# EAGLE design Modulo Actuador (EAGLE 9.3.0)
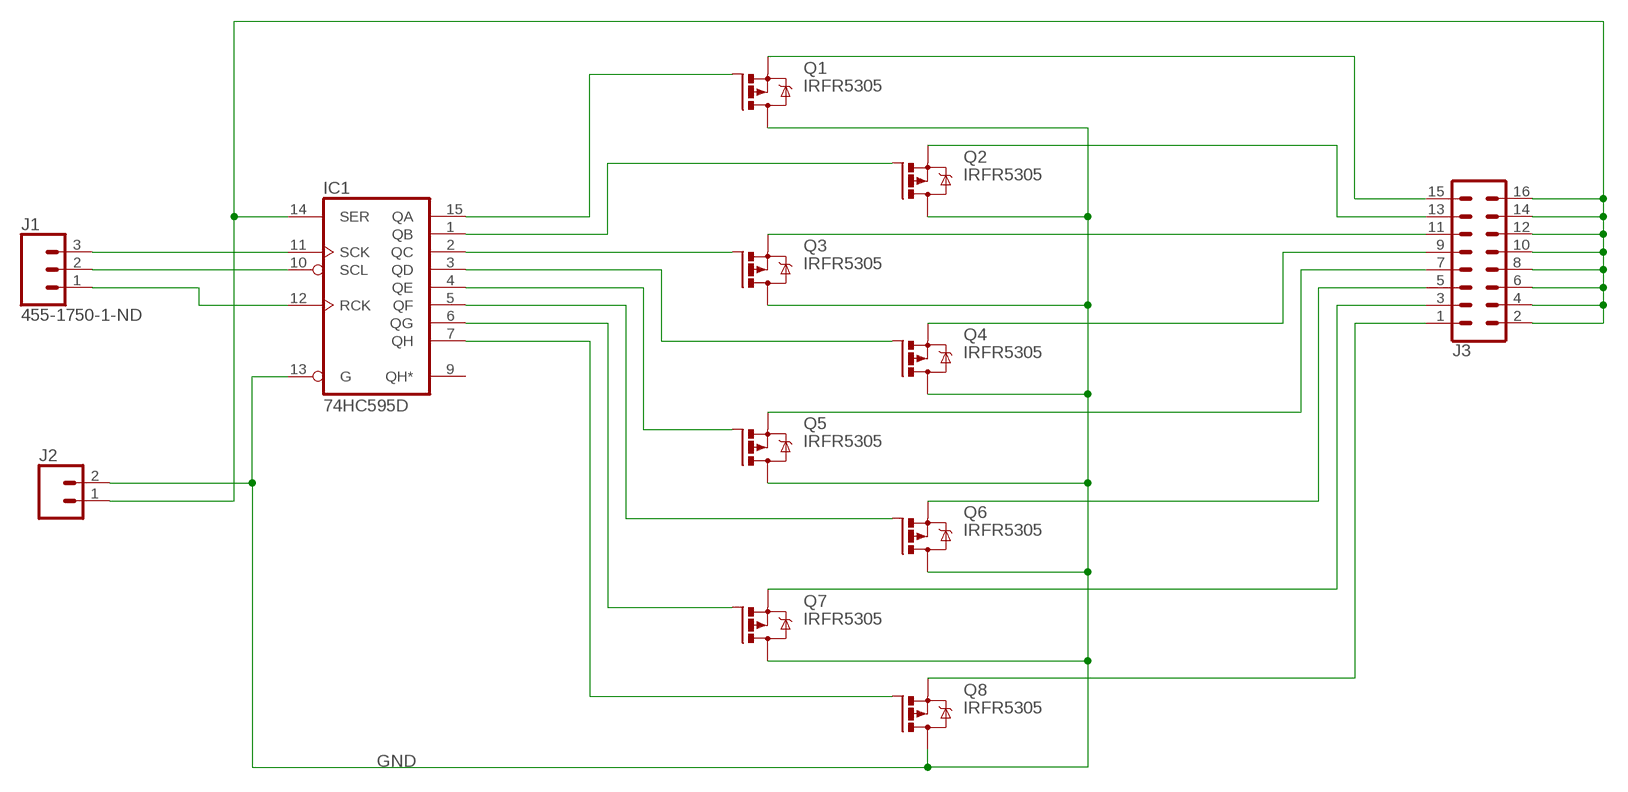
[diagram p0: schematic, sheet 1]

## Parts
IC1  74HC595D  [SO16]
J1  455-1750-1-ND  CONN_03  [1X03]
J2  CONN_02  [1X02]
J3  CONN_08X2_HEADER  [2X8]
Q1  IRFR5305  [D-PAK_TO252AA]
Q2  IRFR5305  [D-PAK_TO252AA]
Q3  IRFR5305  [D-PAK_TO252AA]
Q4  IRFR5305  [D-PAK_TO252AA]
Q5  IRFR5305  [D-PAK_TO252AA]
Q6  IRFR5305  [D-PAK_TO252AA]
Q7  IRFR5305  [D-PAK_TO252AA]
Q8  IRFR5305  [D-PAK_TO252AA]

## Nets
GND: IC1.13(G) J2.2 Q1.4(D) Q2.4(D) Q3.4(D) Q4.4(D) Q5.4(D) Q6.4(D) Q7.4(D) Q8.4(D)
N$1: IC1.14(SER) J2.1 J3.2 J3.4 J3.6 J3.8 J3.10 J3.12 J3.14 J3.16
N$3: IC1.12(RCK) J1.1
N$4: IC1.10(SCL) J1.2
N$5: IC1.11(SCK) J1.3
N$6: IC1.15(QA) Q1.1(G)
N$7: IC1.1(QB) Q2.1(G)
N$8: IC1.2(QC) Q3.1(G)
N$9: IC1.3(QD) Q4.1(G)
N$10: IC1.4(QE) Q5.1(G)
N$11: IC1.5(QF) Q6.1(G)
N$12: IC1.6(QG) Q7.1(G)
N$13: IC1.7(QH) Q8.1(G)
N$14: J3.15 Q1.3(S)
N$15: J3.13 Q2.3(S)
N$16: J3.11 Q3.3(S)
N$17: J3.1 Q8.3(S)
N$18: J3.3 Q7.3(S)
N$19: J3.5 Q6.3(S)
N$20: J3.7 Q5.3(S)
N$21: J3.9 Q4.3(S)
Unconnected: IC1.9(QH*)

## Power pins joined to a net without a drawn wire
GND: IC1.8(GND)
VCC: IC1.16(VCC)

## Library data of the parts
IC1 = 74xx-eu:74*595: 8-bit SHIFT REGISTER, output latch
J1 = SparkFun-Connectors:CONN_03: Multi connection point. Often used as Generic Header-pin footprint for 0.1 inch spaced/style header connections On any of the 0.1 inch spaced packages, you can populate with these: Break Away Headers - Straight <https://www.sparkfun.com/products/116> (PRT-00116) Break Away Male Headers - Right Angle <https://www.sparkfun.com/products/553> (PRT-00553) Female Headers <https://www.sparkfun.com/products/115> (PRT-00115) Break Away Headers - Machine Pin <https://www.sparkfun.com/products/117> (PRT-00117) Break Away Female Headers - Swiss Machine Pin <https://www.sparkfun.com/products/743> (PRT-00743) Stackable Header - 3 Pin (Female, 0.1") <https://www.sparkfun.com/products/13875> (PRT-13875) For SCREWTERMINALS and SPRING TERMINALS visit here: Screw Terimnals on SparkFun.com <https://www.sparkfun.com/search/results?term=Screw+Terminals> (5mm/3.5mm/2.54mm spacing) This device is also useful as a general connection point to wire up your design to another part of your project. Our various solder wires solder well into these plated through hole pads. Hook-Up Wire - Assortment (Stranded, 22 AWG) <https://www.sparkfun.com/products/11375> (PRT-11375) Hook-Up Wire - Assortment (Solid Core, 22 AWG) <https://www.sparkfun.com/products/11367> (PRT-11367) View the entire wire category on our website here <https://www.sparkfun.com/categories/141> Special notes: Molex polarized connector foot print use with SKU : PRT-08232 with associated crimp pins and housings.; PROD_ID: XXX-00000
J2 = SparkFun-Connectors:CONN_02: Multi connection point. Often used as Generic Header-pin footprint for 0.1 inch spaced/style header connections On any of the 0.1 inch spaced packages, you can populate with these: Break Away Headers - Straight <https://www.sparkfun.com/products/116> (PRT-00116) Break Away Male Headers - Right Angle <https://www.sparkfun.com/products/553> (PRT-00553) Female Headers <https://www.sparkfun.com/products/115> (PRT-00115) Break Away Headers - Machine Pin <https://www.sparkfun.com/products/117> (PRT-00117) Break Away Female Headers - Swiss Machine Pin <https://www.sparkfun.com/products/743> (PRT-00743) For SCREWTERMINALS and SPRING TERMINALS visit here: Screw Terimnals on SparkFun.com <https://www.sparkfun.com/search/results?term=Screw+Terminals> (5mm/3.5mm/2.54mm spacing) This device is also useful as a general connection point to wire up your design to another part of your project. Our various solder wires solder well into these plated through hole pads. Hook-Up Wire - Assortment (Stranded, 22 AWG) <https://www.sparkfun.com/products/11375> (PRT-11375) Hook-Up Wire - Assortment (Solid Core, 22 AWG) <https://www.sparkfun.com/products/11367> (PRT-11367) View the entire wire category on our website here <https://www.sparkfun.com/categories/141> Special notes: Molex polarized connector foot print use with: PRT-08233 with associated crimp pins and housings. 2.54_SCREWTERM for use with PRT-10571. 3.5mm Screw Terminal footprints for PRT-08084 5mm Screw Terminal footprints for use with PRT-08432
J3 = SparkFun-Connectors:CONN_08X2: Multi connection point. Often used as Generic Header-pin footprint for 0.1 inch spaced/style header connections You can populate with any combo of single row headers, but if you'd like an exact match, check this: Header - 2x8 (Male, 0.1") <https://www.sparkfun.com/products/13156> (PRT-13156) On any of the 0.1 inch spaced packages, you can populate with these: Break Away Headers - Straight <https://www.sparkfun.com/products/116> (PRT-00116) Break Away Male Headers - Right Angle <https://www.sparkfun.com/products/553> (PRT-00553) Female Headers <https://www.sparkfun.com/products/115> (PRT-00115) Break Away Headers - Machine Pin <https://www.sparkfun.com/products/117> (PRT-00117) Break Away Female Headers - Swiss Machine Pin <https://www.sparkfun.com/products/743> (PRT-00743)
Q1-Q8 = transistor-power:IRF?5305: HEXFET Power MOSFET Source: http://www.irf.com/product-info/datasheets/data/irfr5305pbf.pdf

## Board
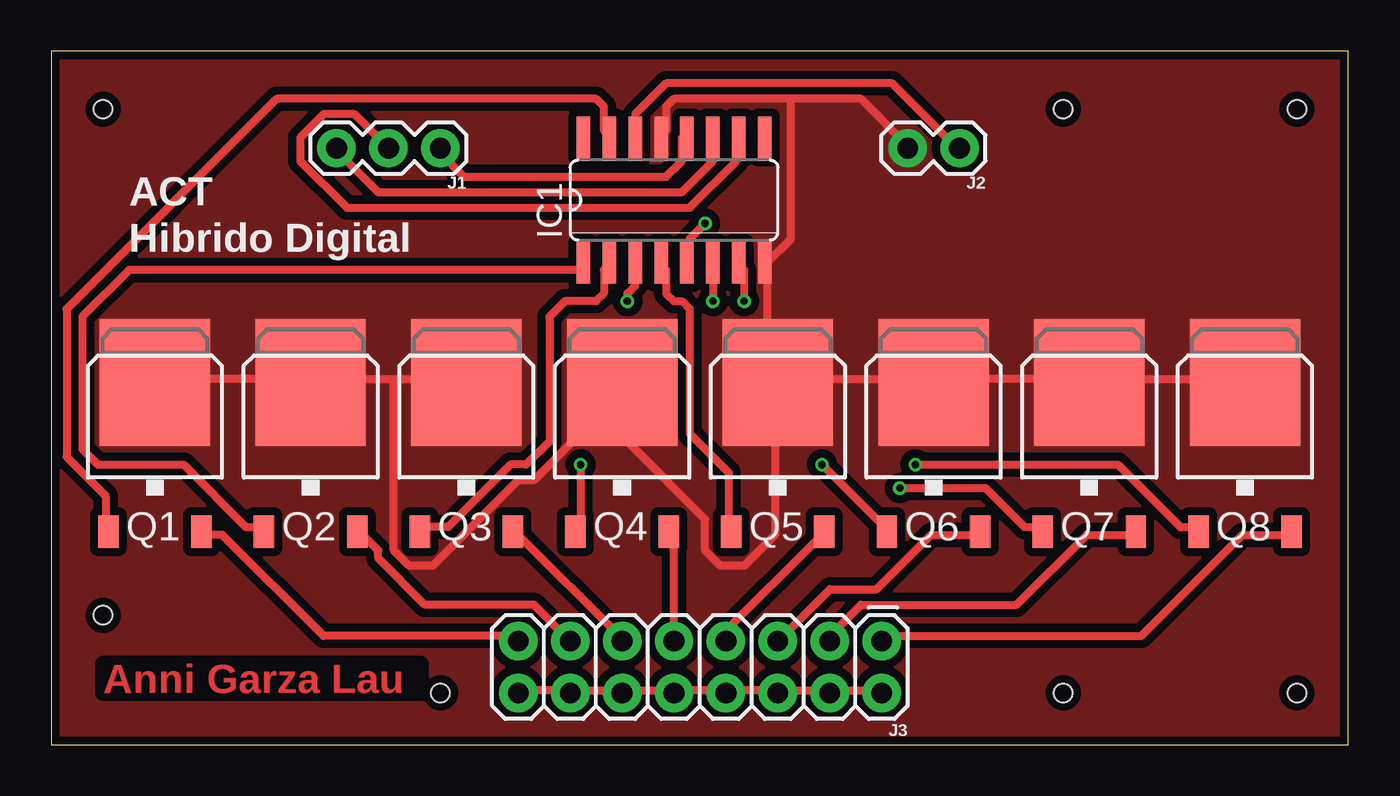
[diagram p1: board, top side]
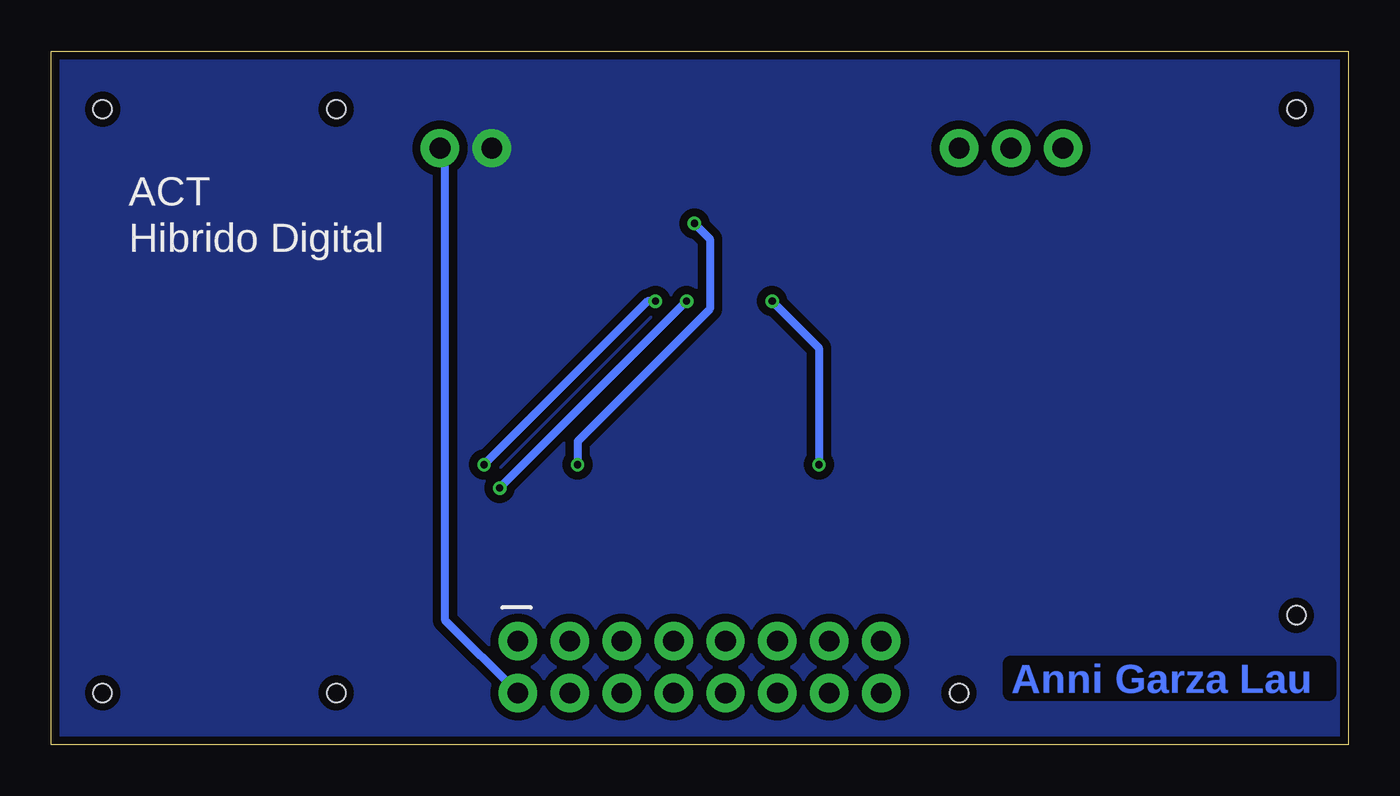
[diagram p2: board, bottom side, seen from below]

Size 63.48 x 33.96 mm. Coordinates in mm from the lower left corner, seen from the top.
Outline: 0,0 63.48,0 63.48,33.96 0,33.96 0,0
Copper layers (1*16): Top 0.035mm / dielectric 1.5mm / Bottom 0.035mm
Design rules "_xircuitos.mx_2L_DRC": minimum track width 6mil, minimum drill 12mil, track to track 6mil, track to pad 6mil, pad to pad 6mil, via to via 6mil, smd to smd 0mil, copper to edge 10mil, drill to drill 12mil, minimum pad ring 10mil, minimum via ring 6mil, stop-mask expansion 2mil, vias tented up to drill 100mil, thermal gap 10mil
Holes 0.9 mm at 2.54,31.11 60.96,31.11 49.53,31.11 60.96,2.54 49.53,2.54 2.54,6.35 19.05,2.54

### Footprints (pad centres in the part's own frame; a part is rotated, then mirrored left to right if it is on the bottom)
SO16 = smd 0.66 x 2.032: 1 -4.445,-3.073; 2 -3.175,-3.073; 3 -1.905,-3.073; 4 -0.635,-3.073; 5 0.635,-3.073; 6 1.905,-3.073; 7 3.175,-3.073; 8 4.445,-3.073; 9 4.445,3.073; 10 3.175,3.073; 11 1.905,3.073; 12 0.635,3.073; 13 -0.635,3.073; 14 -1.905,3.073; 15 -3.175,3.073; 16 -4.445,3.073
1X03 = drill 1.016 pad 1.88: 1 0,0; 2 2.54,0; 3 5.08,0
1X02 = drill 1.016 pad 1.88: 1 0,0; 2 2.54,0
2X8 = drill 1.016 pad 1.88: 1 0,0; 2 0,2.54; 3 2.54,0; 4 2.54,2.54; 5 5.08,0; 6 5.08,2.54; 7 7.62,0; 8 7.62,2.54; 9 10.16,0; 10 10.16,2.54; 11 12.7,0; 12 12.7,2.54; 13 15.24,0; 14 15.24,2.54; 15 17.78,0; 16 17.78,2.54
D-PAK_TO252AA = smd 1 x 1.6: 1 -2.28,-4.8; 3 2.28,-4.8 | smd 5.4 x 6.2: 4 0,2.5

### Placement (x,y rotation side)
IC1  30.48,26.67 0 top
J1  19.05,29.21 180 top
J2  44.45,29.21 180 top
J3  40.64,5.08 180 top
Q1  5.08,15.24 0 top
Q2  12.7,15.24 0 top
Q3  20.32,15.24 0 top
Q4  27.94,15.24 0 top
Q5  35.56,15.24 0 top
Q6  43.18,15.24 0 top
Q7  50.8,15.24 0 top
Q8  58.42,15.24 0 top

### Tracks (layer width: path | path; a pad name or v marks a point on that pad's centre or on a via)
GND
  Top 0.381: Q8.4 58.29,17.91 51.05,17.91 Q7.4 50.67,17.91 43.43,17.91 Q6.4 43.05,17.91 35.81,17.91 Q5.4 | Q1.4 5.33,17.91 12.57,17.91 Q2.4 12.95,17.91 16.76,17.91 | 16.76,17.91 20.19,17.91 Q3.4 | 36.2,31.62 39.62,31.62 41.91,29.34 J2.2 | 36.2,31.62 30.48,31.62 30.1,31.24 30.1,30.1 IC1.13 | Q5.4 35.43,17.91 35.05,18.29 35.05,23.24 IC1.8 35.05,23.62 36.2,24.77 36.2,31.62 | 28.19,14.86 28.19,17.53 Q4.4 28.19,14.86 | 28.19,14.86 32,11.05 32,9.53 32.77,8.76 33.91,8.76 35.43,10.29 35.43,17.53 Q5.4 | 16.76,17.91 16.76,9.53 17.53,8.76 18.67,8.76 22.86,12.95 23.62,12.95 25.53,14.86 28.19,14.86
  pour Top (isolate 0.406, no thermals): 0,0 0,34.29 63.5,34.29 63.5,0
  pour Bottom (isolate 0.406, no thermals): 0,0 0,34.29 63.5,34.29 63.5,0
N$1
  Top 0.381: IC1.14 28.57,30.86 30.1,32.38 41.15,32.38 44.2,29.34 J2.1 | J3.16 22.86,2.67 25.15,2.67 J3.14 25.53,2.67 27.81,2.67 J3.12 28.19,2.67 30.48,2.67 | 38.1,2.67 35.81,2.67 J3.6 35.43,2.67 33.15,2.67 J3.8 32.77,2.67 30.48,2.67 | 38.1,2.67 40.39,2.67 J3.2 | 38.1,2.67 J3.4 | 30.48,2.67 J3.10
  Bottom 0.381: J3.2 44.2,6.1 44.2,28.96 J2.1
N$3
  Top 0.381: IC1.12 30.86,29.72 30.86,28.57 30.1,27.81 20.19,27.81 19.05,28.96 J1.1
N$4
  Top 0.381: J1.2 14.86,30.86 13.34,30.86 12.19,29.72 12.19,28.57 14.48,26.29 31.24,26.29 33.53,28.57 33.53,29.72 IC1.10
N$5
  Top 0.381: IC1.11 32.38,28.57 30.86,27.05 16,27.05 14.1,28.96 J1.3
N$6
  Top 0.381: Q1.1 2.67,10.67 2.67,12.19 0.76,14.1 0.76,21.34 11.05,31.62 26.67,31.62 27.05,31.24 27.05,30.1 IC1.15
N$7
  Top 0.381: Q2.1 10.29,10.67 9.53,10.67 6.48,13.72 2.29,13.72 1.52,14.48 1.52,20.95 3.81,23.24 25.91,23.24 IC1.1
N$8
  Top 0.381: Q3.1 18.29,10.67 19.43,10.67 22.48,13.72 23.24,13.72 24.38,14.86 24.38,20.95 25.15,21.72 26.67,21.72 27.05,22.1 27.05,23.24 IC1.2
N$9  (via drill 0.35)
  Top 0.381: v25.91,13.72 25.91,10.67 Q4.1 | v28.19,21.72 28.19,22.1 28.57,22.48 IC1.3
  Bottom 0.381: v25.91,13.72 25.91,19.43 v28.19,21.72
N$10
  Top 0.381: Q5.1 33.15,10.67 33.15,13.34 31.24,15.24 31.24,21.34 30.86,21.72 30.48,21.72 30.1,22.1 30.1,23.24 IC1.4
N$11  (via drill 0.35)
  Top 0.381: v37.72,13.72 40.77,10.67 Q6.1 | v32,25.53 31.24,24.77 31.24,23.62 IC1.5
  Bottom 0.381: v37.72,13.72 37.72,14.86 31.24,21.34 31.24,24.77 v32,25.53
N$12  (via drill 0.35)
  Top 0.381: v41.53,12.57 45.72,12.57 47.62,10.67 48.39,10.67 Q7.1 | IC1.6 v32.38,21.72
  Bottom 0.381: v32.38,21.72 v41.53,12.57
N$13  (via drill 0.35)
  Top 0.381: v42.29,13.72 52.2,13.72 55.24,10.67 56.01,10.67 Q8.1 | v33.91,21.72 33.91,23.24 IC1.7
  Bottom 0.381: v42.29,13.72 34.29,21.72 v33.91,21.72
N$14
  Top 0.381: Q1.3 7.62,10.29 8.38,10.29 13.34,5.33 22.86,5.33 J3.15
N$15
  Top 0.381: J3.13 23.62,6.86 18.29,6.86 16,9.14 16,9.53 15.24,10.29 Q2.3
N$16
  Top 0.381: Q3.3 22.86,10.29 27.81,5.33 J3.11
N$17
  Top 0.381: Q8.3 60.58,10.29 58.29,10.29 53.34,5.33 40.77,5.33 J3.1
N$18
  Top 0.381: Q7.3 52.96,10.29 50.67,10.29 47.24,6.86 39.62,6.86 38.1,5.33 J3.3
N$19
  Top 0.381: J3.5 38.1,7.62 40.39,7.62 43.05,10.29 45.34,10.29 Q6.3
N$20
  Top 0.381: Q5.3 37.72,10.29 32.77,5.33 J3.7
N$21
  Top 0.381: J3.9 30.48,10.29 Q4.3

### Text on the board
Top: Anni Garza Lau
Bottom: Anni Garza Lau
tPlace: ACT / Hibrido Digital
bPlace: ACT / Hibrido Digital